# Altium schematic sheet Memory.SchDoc
size A4; SheetNumber: 3; SheetTotal: 7
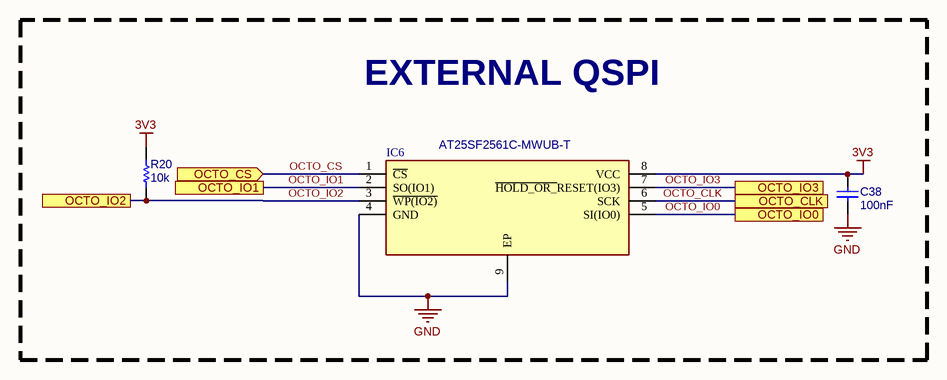
[diagram p0: Memory.SchDoc]

## Parts
C38  value 100nF  [C0603]  (hidden comment: MCD-00237)
IC6  AT25SF2561C-MWUB-T  [SON127P800X600X80-9N-D]
R20  value 10k  [RESC1608X55X25ML10T15-1]  (hidden comment: Resistor 10k +/-1% 0603 100mW)

## Blocks framed on the sheet
EXTERNAL QSPI: C38 IC6 R20

## Ports
OCTO_CLK, OCTO_CS (in), OCTO_IO0, OCTO_IO1, OCTO_IO2, OCTO_IO3

## Nets
3V3: C38.1 IC6.8(VCC) R20.2
GND: C38.2 IC6.4(GND) IC6.9(EP)
OCTO_CLK: IC6.6(SCK) ; port OCTO_CLK
OCTO_CS: IC6.1(~{CS}) ; port OCTO_CS
OCTO_IO0: IC6.5(SI(IO0)) ; port OCTO_IO0
OCTO_IO1: IC6.2(SO(IO1)) ; port OCTO_IO1
OCTO_IO2: IC6.3(~{WP(IO2)}) R20.1 ; port OCTO_IO2
OCTO_IO3: IC6.7(~{HOLD_OR_}RESET(IO3)) ; port OCTO_IO3

## Library data of the parts
C38 = CMP-112-000001-1: Capacitor, MLCC, 100nF, 6V3, X5R, 10%, 0603, T=0,8mm; Manufacturer Part Number: CC0603KRX5R5BB104; Manufacturer: YAGEO; ECCN_EU: NEC; Provided_By: SUBCO; ECCN_US: EAR99; Status: Released; ComponentLink1Description: Datasheet; Component Type: Capacitors; Pin Count: 2; Package: C0603; Source: MB1364.SCHLIB; Design Item ID: MCD-00237; Part_Type: Capacitor; Internal_Part_Number: MCD-00237; ComponentLink1URL: http://tunmcdsvn.tun.st.com/Component_Datasheet_Library/Trunk/Capacitors/Yageo_Multilayer_capacitor_X5R_series_100pF_to_100uF; Manufacturer_Part_Number: CC0603KRX5R5BB104
IC6 = AT25SF2561C-MWUB-T: Integrated Circuit; Manufacturer_Name: Renesas Electronics; Datasheet Link: https://www.renesas.com/us/en/products/memory-logic/non-volatile-memory/spi-nor-flash/at25sf2561c-256mbit-3v-spi-serial-flash-memory-single-dual-quad-io-qpi-and-dtr-support; Height: 0.8mm; Manufacturer_Part_Number: AT25SF2561C-MWUB-T
R20 = CMP-009-00181-1: Chip Resistor, 10k Ohm, 0.1 W, -55 to 155 degC, 0603 (1608 Metric); Voltage Rating: 50V; Tolerance: 1%; Source: Components - 14.11.22 - 11.28.SchLib; Design Item ID: CMP-009-00006-5; Created by: Micah Randall; Power: 100mW; Max Operating Temperature: 155°C; RoHS Compliant: Yes; Mounting Technology: SM; Case/Package: 0603; Min Operating Temperature: -55°C; Pins: 2